# EAGLE design Led PCB v2.0 (EAGLE 9.5.2)
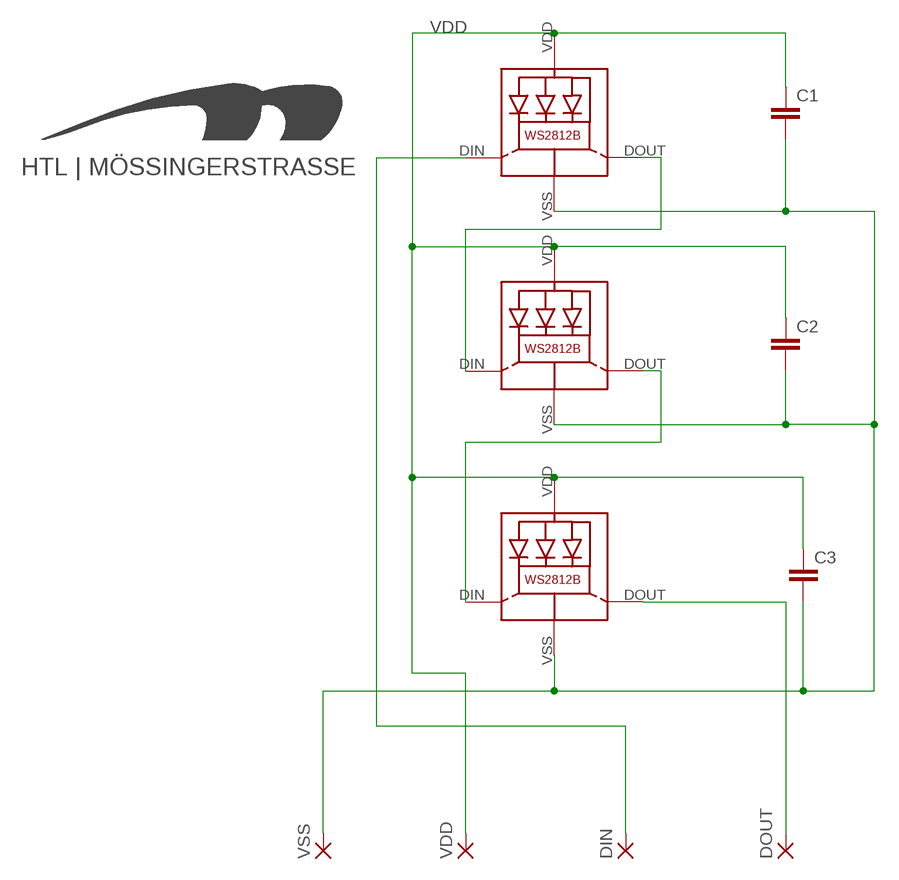
[diagram p0: schematic, sheet 1]

## Parts
C1  C-EUC0805  [C0805]
C2  C-EUC0805  [C0805]
C3  C-EUC0805  [C0805]
DIN  SMD2  [SMD1,27-2,54]
DOUT  SMD2  [SMD1,27-2,54]
LED1  WS2812B  [WS2812B]
LED2  WS2812B  [WS2812B]
LED3  WS2812B  [WS2812B]
U$1  HTL_LOGOTOP_8MM  [LOGOTOP_8]
VDD  SMD2  [SMD1,27-2,54]
VSS  SMD2  [SMD1,27-2,54]

## Nets
DIN: DIN.1(P) LED1.DIN(DI)
DOUT: DOUT.1(P) LED3.DOUT(DO)
GND: C1.2 C2.2 C3.2 LED1.VSS(GND) LED2.VSS(GND) LED3.VSS(GND) VSS.1(P)
N$7: LED2.DOUT(DO) LED3.DIN(DI)
N$8: LED1.DOUT(DO) LED2.DIN(DI)
VDD: C1.1 C2.1 C3.1 LED1.VDD LED2.VDD LED3.VDD VDD.1(P)

## Library data of the parts
C1-C3 = rcl:C-EU: CAPACITOR, European symbol; SPICEPREFIX: C
DIN DOUT VDD VSS = wirepad:SMD2: SMD PAD
LED1-LED3 = WS2812B:WS2812B: Features and Benefits  * Intelligent reverse connect protection, the power supply reverse connection does not damage the IC. * The control circuit and the LED share the only power source. Control circuit and RGB chip are integrated in a package of 5050 components, form a complete control of pixel point.  * Built-in signal reshaping circuit, after wave reshaping to the next driver, ensure wave-form distortion not accumulate.  * Built-in electric reset circuit and power lost reset circuit.  * Each pixel of the three primary color can achieve 256 brightness display, completed 16777216 color full color display, and scan frequency not less than 400Hz/s.  * Cascading port transmission signal by single line.  * Any two point the distance more than 5m transmission signal without any increase circuit.  * When the refresh rate is 30fps, cascade number are not less than1024 points.  * Send data at speeds of 800Kbps.  *The color of the light were highly consistent, cost-effective. Applications  Full-color module, Full color soft lights a lamp strip. LED decorative lighting, Indoor/outdoor LED video irregular screen. General description WS2812B is a intelligent control LED light source that the control circuit and RGB chip are integrated in a package of 5050 components. It internal include intelligent digital port data latch and signal reshaping amplification drive circuit. Also include a precision internal oscillator and a 12V voltage programmable constant curre-nt control part, effectively ensuring the pixel point light color height consistent. The data transfer protocol use single NZR communication mode. After the pixel power-on reset, the DIN port receive data from controller, the first pixel collect initial 24bit data then sent to the internal data latch, the other data which reshaping by the internal signal reshaping amplification circuit sent to the next cascade pixel through the DO port. After transmission for each pixel,the signal to reduce 24bit. pixel adopt auto reshaping transmit technology, making the pixel cascade number is not limited the signal transmission, only depend on the speed of signal transmission. LED with low driving voltage, environmental protection and energy saving, high brightness, scattering angle is large, good consistency, low power, long life and other advantages. The control chip integrated in LED above becoming more simple circuit, small volume, convenient installation. Absolute Maximum Ratings Power supply voltage: VDD +3.5V..+5.3V Input voltage: VI -0.5V..VDD+0.5V based on WS2812 from https://github.com/adafruit/Adafruit-Eagle-Library
U$1 = HTL-Logo:HTL_LOGO

## Board
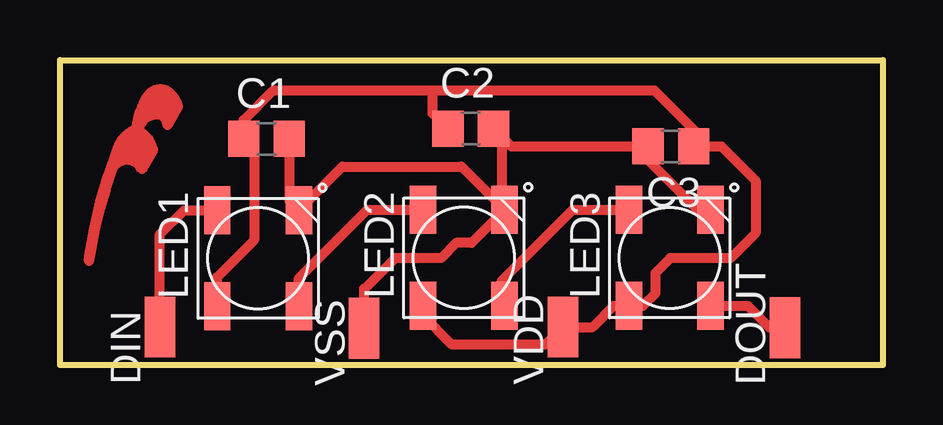
[diagram p1: board, top side]

Size 34.29 x 12.7 mm. Coordinates in mm from the lower left corner, seen from the top.
Outline: 0,0 34.29,0 34.29,12.7 0,12.7 0,0
Copper layers (1*16): Top 0.035mm / dielectric 1.5mm / Bottom 0.035mm
Design rules "default *": minimum track width 16mil, minimum drill 0.35mm, track to track 16mil, track to pad 16mil, pad to pad 16mil, via to via 16mil, smd to smd 16mil, copper to edge 30mil, drill to drill 6mil, minimum pad ring 10mil, minimum via ring 8mil, stop-mask expansion 4mil, vias tented up to drill 0mil, thermal gap 10mil

### Footprints (pad centres in the part's own frame; a part is rotated, then mirrored left to right if it is on the bottom)
C0805 = smd 1.3 x 1.5: 1 -0.95,0; 2 0.95,0
SMD1,27-2,54 = smd 1.27 x 2.54: 1 0,0
WS2812B = smd 2 x 1.1: DIN 2,1.7; DOUT -2,-1.7; VDD -2,1.7; VSS 2,-1.7

### Placement (x,y rotation side)
C1  8.61,9.41 0 top
C2  17.11,9.85 0 top
C3  25.45,9.1 180 top
DIN  4.17,1.57 0 top
DOUT  30.2,1.55 0 top
LED1  8.25,4.44 90 top
LED2  16.83,4.46 90 top
LED3  25.4,4.45 90 top
U$1  3.81,8.89 60 top
VDD  20.95,1.57 0 top
VSS  12.67,1.52 0 top

### Tracks (layer width: path | path; a pad name or v marks a point on that pad's centre or on a via)
DIN
  Top 0.406: DIN.1 4.17,5.44 5.17,6.44 LED1.DIN
DOUT
  Top 0.406: DOUT.1 29.57,1.55 28.66,2.45 LED3.DOUT
GND
  Top 0.406: C1.2 9.55,6.83 LED1.VSS 11.77,8.26 16.73,8.26 LED2.VSS | LED2.VSS 18.41,6.57 18.41,9.49 C2.2 18.81,9.1 C3.2 24.5,8.52 26.57,6.45 LED3.VSS | LED2.VSS 17.15,5.08 16.51,5.08 15.88,4.45 13.97,4.45 12.7,3.17 12.68,3.17 VSS.1
N$7
  Top 0.406: 18.61,2.54 LED2.DOUT 18.41,2.57 18.41,3.5 21.36,6.45 LED3.DIN
N$8
  Top 0.406: LED2.DIN 12.81,6.46 9.95,3.6 LED1.DOUT
VDD
  Top 0.406: 15.53,11.43 8.89,11.43 7.66,10.2 C1.1 8.09,8.98 8.09,5.19 6.55,3.65 LED1.VDD | 15.53,11.43 15.53,10.48 C2.1 | 15.53,11.43 24.77,11.43 26.67,9.53 26.67,9.37 C3.1 27.55,9.1 28.98,7.67 28.98,5.49 27.94,4.45 25.43,4.45 24.82,3.83 24.82,2.98 24.29,2.45 LED3.VDD 23.07,2.45 22.19,1.57 VDD.1 20.22,0.84 16.33,0.84 15.13,2.04 LED2.VDD